# Altium schematic sheet 6_LED INTERFACE SFP.SchDoc
size 419 x 296 mm; Author: Serbinov O.A.; CompanyName: ELSICOM; DrawnBy: Serbinov O.A.; Engineer: Serbinov O.A.; Organization: Elsicom; Address1: Kirova avenue, 58; Address2: Tomsk; Address3: Russia 634012; DocumentNumber: 7; SheetNumber: 7; SheetTotal: 44; ProjectName: 48_PORTS
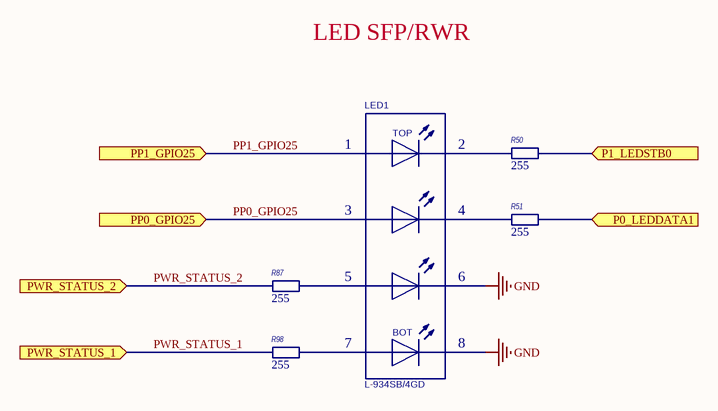
[diagram p0: 6_LED INTERFACE SFP.SchDoc]

## Parts
LED1  L-934SB/4GD  [L-934SB/4GD]
R50  Resistance (Ohms): 255  [RESC1005[0402]]  (hidden comment: ERJ-2RKF2550X)
R51  Resistance (Ohms): 255  [RESC1005[0402]]  (hidden comment: ERJ-2RKF2550X)
R87  Resistance (Ohms): 255  [RESC1005[0402]]  (hidden comment: ERJ-2RKF2550X)
R98  Resistance (Ohms): 255  [RESC1005[0402]]  (hidden comment: ERJ-2RKF2550X)

## Ports
P0_LEDDATA1 (in), P1_LEDSTB0 (in), PP0_GPIO25 (in), PP1_GPIO25 (in), PWR_STATUS_1 (in), PWR_STATUS_2 (in)

## Nets
GND: LED1.6 LED1.8
P0_LEDDATA1: R51.2 ; port P0_LEDDATA1
P1_LEDSTB0: R50.2 ; port P1_LEDSTB0
PP0_GPIO25: LED1.3 ; port PP0_GPIO25
PP1_GPIO25: LED1.1 ; port PP1_GPIO25
PWR_STATUS_1: R98.1 ; port PWR_STATUS_1
PWR_STATUS_2: R87.1 ; port PWR_STATUS_2
NetLED1_2: LED1.2 R50.1
NetLED1_4: LED1.4 R51.1
NetLED1_5: LED1.5 R87.2
NetLED1_7: LED1.7 R98.2

## Notes on the sheet
- LED SFP/RWR
- A3
- SIZE
- PROJECT
- SHEET
- OF
- Engineer: Oleg Serbinov
- (in symbol L-934SB/4GD) TOP; BOT

## Library data of the parts
LED1 = L-934SB/4GD: 4 LED Green L-934SB/4GD; Customer Part Number: Светодиод, 4 LED Green L-934SB/4GD QUAD-LEVEL LED INDICATORS; Manufacturer: Kingbright; Analogs: BL-34GGGG-4; Manufacturer Part Number: L-934SB/4GD
R50 R51 R87 R98 = ERJ-2RKF2550X: R0402, 255R 1%; Manufacturer: Panasonic; Customer Part Number: Резистор, 255R, 0402, 1%; Temperature Coefficient: ±100ppm/°C; Power (Watts): 0.1W, 1/10W; Analogs: any suitable; Category: Resistors; Supplier: Digi-Key; Supplier Part Number: P255LDKR-ND; RoHS: RoHS Compliant; Manufacturer Part Number: ERJ-2RKF2550X; Packaging: Digi-Reel®; Composition: Thick Film; Number of Terminations: 2; Height: 0.016" (0.40mm); Size / Dimension: 0.039" L x 0.020" W (1.00mm x 0.50mm); Tolerance: ±1%; Features: -; Package / Case: 0402 (1005 Metric); ComponentLink1URL: http://industrial.panasonic.com/www-cgi/jvcr13pz.cgi?E+PZ+3+AOA0002+ERJ2RKF2550X+7+WW; ComponentLink1Description: http://industrial.panasonic.com/www-cgi/jvcr13pz.cgi?E+PZ+3+AOA0002+ERJ2RKF2550X+7+WW; Pricing: 1=0.1, 50=0.0242, 100=0.0184, 250=0.01364, 500=0.01008, 1000=0.00672, 5000=0.00473 (USD)